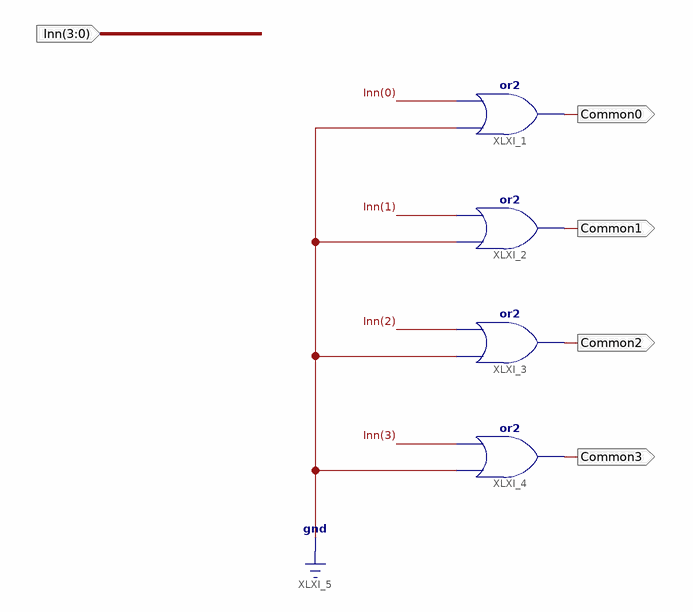
[diagram p0: schematic sheet 1]
// Xilinx ISE schematic CommonAll.sch (spartan6) as structural Verilog: 4 symbols, 5 ports
module CommonAll (
  input  [3:0] Inn,
  output Common0,
  output Common1,
  output Common2,
  output Common3
);

  or XLXI_1 (Common0, 1'b0, Inn[0]);
  or XLXI_2 (Common1, 1'b0, Inn[1]);
  or XLXI_3 (Common2, 1'b0, Inn[2]);
  or XLXI_4 (Common3, 1'b0, Inn[3]);
endmodule
